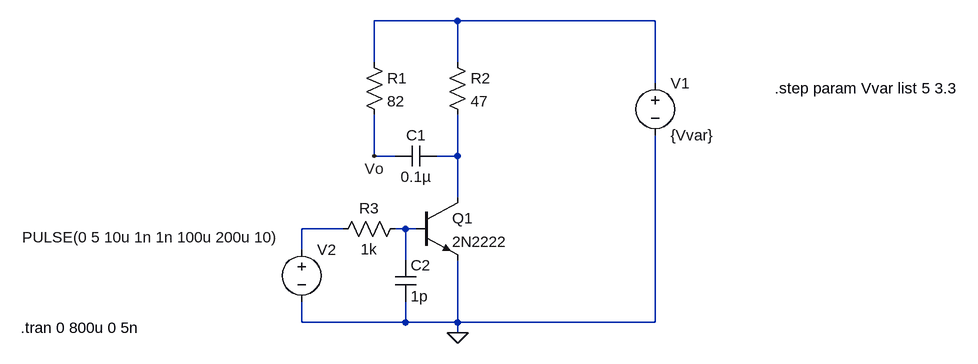
[diagram p0: schematic NegativePulse.asc]
NegativePulse.asc, the LTspice schematic file:
Version 4
SHEET 1 1036 680
WIRE 240 -32 112 -32
WIRE 544 -32 240 -32
WIRE 112 32 112 -32
WIRE 240 32 240 -32
WIRE 544 64 544 -32
WIRE 112 176 112 112
WIRE 144 176 112 176
WIRE 240 176 240 112
WIRE 240 176 208 176
WIRE 240 240 240 176
WIRE 64 288 0 288
WIRE 160 288 144 288
WIRE 176 288 160 288
WIRE 0 320 0 288
WIRE 160 336 160 288
WIRE 0 432 0 400
WIRE 160 432 160 400
WIRE 160 432 0 432
WIRE 240 432 240 336
WIRE 240 432 160 432
WIRE 544 432 544 144
WIRE 544 432 240 432
WIRE 240 448 240 432
FLAG 112 176 Vo
FLAG 240 448 0
SYMBOL res 96 16 R0
SYMATTR InstName R1
SYMATTR Value 82
SYMBOL res 224 16 R0
SYMATTR InstName R2
SYMATTR Value 47
SYMBOL cap 208 160 R90
WINDOW 0 0 32 VBottom 2
WINDOW 3 32 32 VTop 2
SYMATTR InstName C1
SYMATTR Value 0.1µ
SYMBOL voltage 544 48 R0
WINDOW 123 0 0 Left 0
WINDOW 39 0 0 Left 0
SYMATTR InstName V1
SYMATTR Value {Vvar}
SYMBOL npn 176 240 R0
SYMATTR InstName Q1
SYMATTR Value 2N2222
SYMBOL voltage 0 304 R0
WINDOW 3 -430 -3 Left 2
WINDOW 123 0 0 Left 0
WINDOW 39 0 0 Left 0
SYMATTR Value PULSE(0 5 10u 1n 1n 100u 200u 10)
SYMATTR InstName V2
SYMBOL res 160 272 R90
WINDOW 0 0 56 VBottom 2
WINDOW 3 32 56 VTop 2
SYMATTR InstName R3
SYMATTR Value 1k
SYMBOL cap 144 336 R0
SYMATTR InstName C2
SYMATTR Value 1p
TEXT -432 440 Left 2 !.tran 0 800u 0 5n
TEXT 728 72 Left 2 !.step param Vvar list 5 3.3

The netlist it stands for:
* NegativePulse.asc
R1 N001 Vo 82
R2 N001 N002 47
C1 N002 Vo 0.1µ
V1 N001 0 {Vvar}
Q1 N002 N004 0 0 2N2222
V2 N003 0 PULSE(0 5 10u 1n 1n 100u 200u 10)
R3 N004 N003 1k
C2 N004 0 1p
.model NPN NPN
.model PNP PNP
.lib standard.bjt
.tran 0 800u 0 5n
.step param Vvar list 5 3.3
.backanno
.end